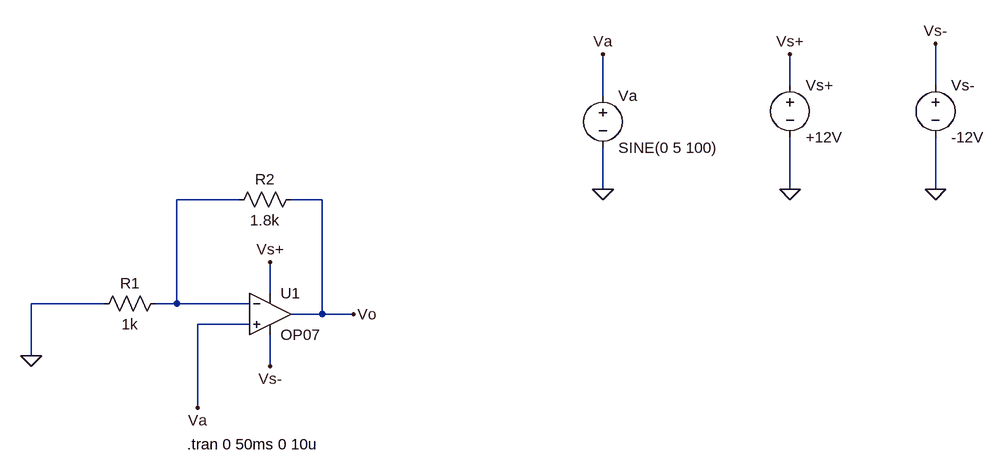
[diagram p0: schematic exp2.asc]
exp2.asc, the LTspice schematic file:
Version 4
SHEET 1 1508 680
WIRE 1184 -112 1184 -160
WIRE 1408 -112 1408 -176
WIRE 896 -96 896 -160
WIRE 896 48 896 -16
WIRE 1184 48 1184 -32
WIRE 1408 48 1408 -32
WIRE 336 64 240 64
WIRE 464 64 416 64
WIRE 384 208 384 160
WIRE 128 224 16 224
WIRE 240 224 240 64
WIRE 240 224 208 224
WIRE 352 224 240 224
WIRE 464 240 464 64
WIRE 464 240 416 240
WIRE 512 240 464 240
WIRE 352 256 272 256
WIRE 16 304 16 224
WIRE 384 320 384 272
WIRE 272 384 272 256
FLAG 896 48 0
FLAG 1184 48 0
FLAG 1408 48 0
FLAG 272 384 Va
FLAG 384 160 Vs+
FLAG 384 320 Vs-
FLAG 512 240 Vo
FLAG 16 304 0
FLAG 896 -160 Va
FLAG 1184 -160 Vs+
FLAG 1408 -176 Vs-
SYMBOL res 224 208 R90
WINDOW 0 0 56 VBottom 2
WINDOW 3 32 56 VTop 2
SYMATTR InstName R1
SYMATTR Value 1k
SYMBOL res 432 48 R90
WINDOW 0 0 56 VBottom 2
WINDOW 3 32 56 VTop 2
SYMATTR InstName R2
SYMATTR Value 1.8k
SYMBOL OpAmps\\OP07 384 176 R0
SYMATTR InstName U1
SYMBOL voltage 1184 -128 R0
SYMATTR InstName Vs+
SYMATTR Value +12V
SYMBOL voltage 1408 -128 R0
SYMATTR InstName Vs-
SYMATTR Value -12V
SYMBOL voltage 896 -112 R0
WINDOW 123 0 0 Left 0
WINDOW 39 0 0 Left 0
SYMATTR InstName Va
SYMATTR Value SINE(0 5 100)
TEXT 256 440 Left 2 !.tran 0 50ms 0 10u

The netlist it stands for:
* exp2.asc
R1 N001 0 1k
R2 Vo N001 1.8k
XU1 Va N001 Vs+ Vs- Vo LT1001  ; OP07, pins In+ In- V+ V- OUT
Vs+ Vs+ 0 +12V
Vs- Vs- 0 -12V
Va Va 0 SINE(0 5 100)
.tran 0 50ms 0 10u
.lib LTC.lib
.backanno
.end